# Altium schematic sheet Sheet1.SchDoc
size A4
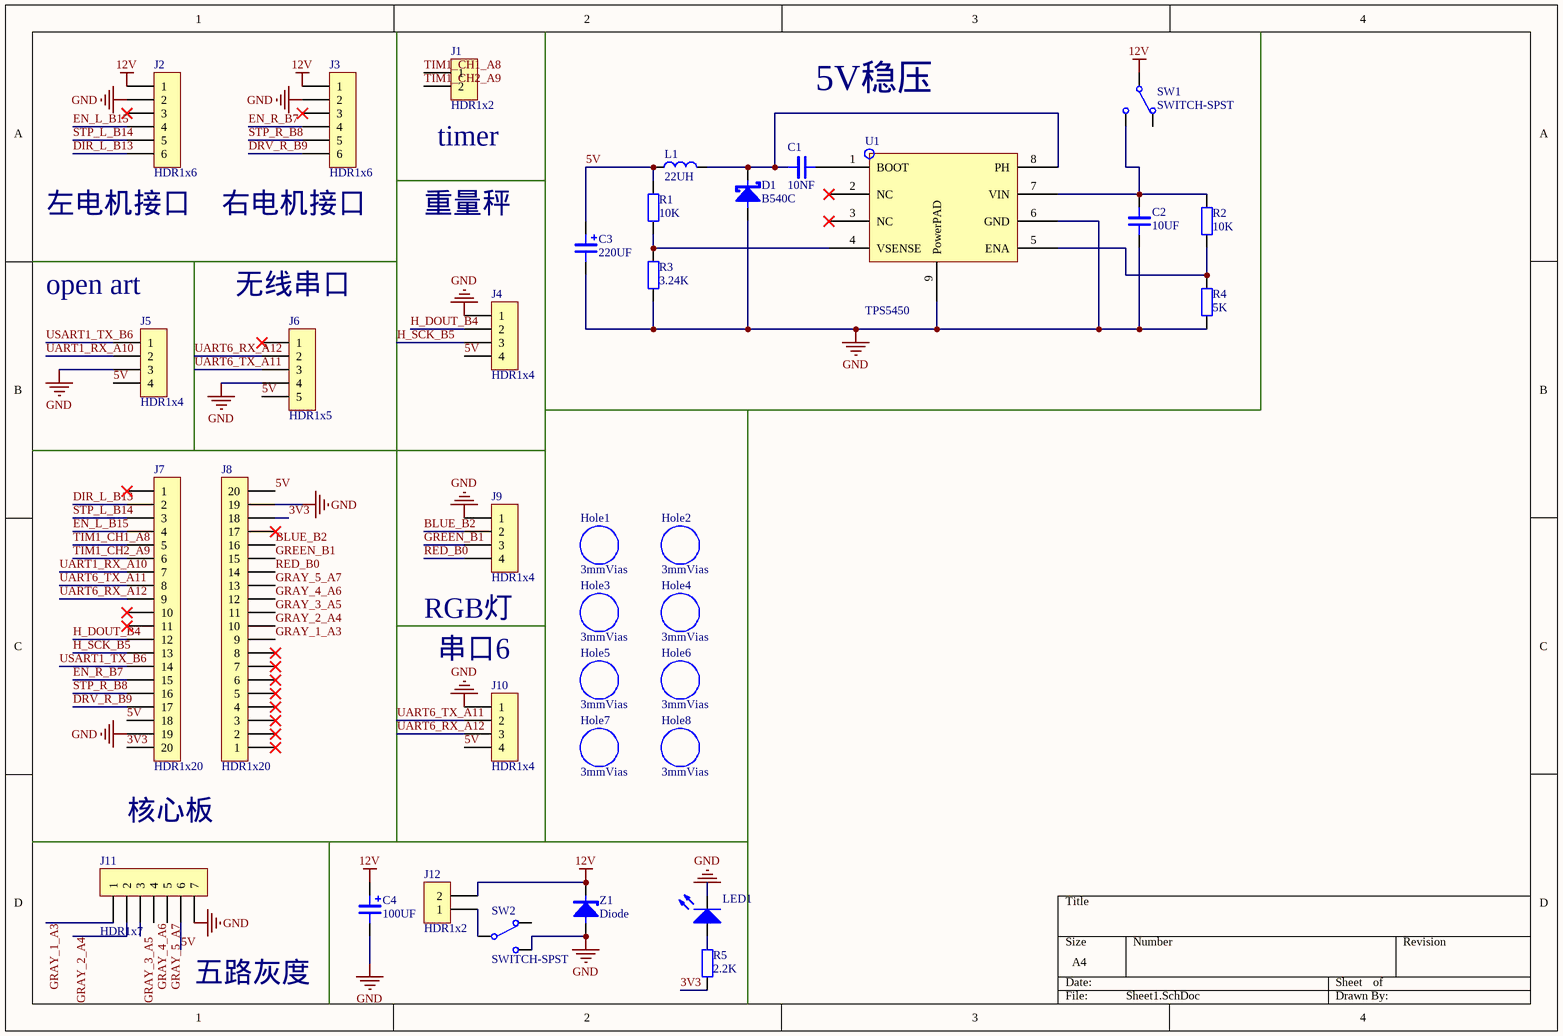
[diagram p0: Sheet1.SchDoc]

## Parts
C1  10NF  [0603]
C2  10UF  [0603]
C3  220UF  [DIP-EC3.5X8X11.5]
C4  100UF  [DIP-EC2.5X6.3X11.2]
D1  B540C  [SMC]
Hole1  3mmVias  [3mm]
Hole2  3mmVias  [3mm]
Hole3  3mmVias  [3mm]
Hole4  3mmVias  [3mm]
Hole5  3mmVias  [3mm]
Hole6  3mmVias  [3mm]
Hole7  3mmVias  [3mm]
Hole8  3mmVias  [3mm]
J1  HDR1x2  [PIN-2-2.54-1.0]
J2  HDR1x6  [XH6/2.54mm/90]
J3  HDR1x6  [XH6/2.54mm/90]
J4  HDR1x4  [PIN-4-2.54-1.0]
J5  HDR1x4  [XH4/2.54mm/180]
J6  HDR1x5  [PIN-5-2.54-1.0]
J7  HDR1x20  [Fe-HDR1X20/2.54-S]
J8  HDR1x20  [Fe-HDR1X20/2.54-S]
J9  HDR1x4  [PIN-4-2.54-1.0]
J10  HDR1x4  [XH4/2.54mm/180]
J11  HDR1x7  [PIN-7-2.54-1.0]
J12  HDR1x2  [KF301]
L1  22UH  [CDRH127]
LED1  LED0  [0603-led]  (value not drawn)
R1  10K  [0603]
R2  10K  [0603]
R3  3.24K  [0603]
R4  5K  [0603]
R5  2.2K  [0603]
SW1  SWITCH-SPST  [ss12d10]
SW2  SWITCH-SPST  [ss12d10]
U1  TPS5450  [TPS5450]
Z1  Diode  [1N5824]

## Nets
12V: C4.1 J2.1 J3.1 J12.2 SW1.2 Z1.2(C)
GND: C2.1 C3.2 C4.2 D1.1(A) J2.2 J3.2 J4.1 J5.3 J6.4 J7.19 J8.19 J9.1 J10.1 J11.7 LED1.2(K) R3.1 R4.1 SW2.3 U1.6(GND) U1.9(PowerPAD) Z1.1(A)
3V3: J7.20 J8.18 R5.1
5V: C3.1 J4.4 J5.4 J6.5 J7.18 J8.20 J10.4 J11.6 L1.1 R1.2
BLUE_B2: J8.16 J9.2
DIR_L_B13: J2.6 J7.2
DRV_R_B9: J3.6 J7.17
EN_L_B15: J2.4 J7.4
EN_R_B7: J3.4 J7.15
GRAY_1_A3: J8.9 J11.1
GRAY_2_A4: J8.10 J11.2
GRAY_3_A5: J8.11 J11.3
GRAY_4_A6: J8.12 J11.4
GRAY_5_A7: J8.13 J11.5
GREEN_B1: J8.15 J9.3
H_DOUT_B4: J4.2 J7.12
H_SCK_B5: J4.3 J7.13
RED_B0: J8.14 J9.4
STP_L_B14: J2.5 J7.3
STP_R_B8: J3.5 J7.16
TIM1_CH1_A8: J1.1 J7.5
TIM1_CH2_A9: J1.2 J7.6
UART1_RX_A10: J5.2 J7.7
UART6_RX_A12: J6.2 J7.9 J10.3
UART6_TX_A11: J6.3 J7.8 J10.2
USART1_TX_B6: J5.1 J7.14
NetC1_1: C1.1 U1.1(BOOT)
NetC1_2: C1.2 D1.2(C) L1.2 U1.8(PH)
NetC2_2: C2.2 R2.2 SW1.3 U1.7(VIN)
NetJ12_1: J12.1 SW2.2
NetLED1_1: LED1.1(A) R5.2
NetR1_1: R1.1 R3.2 U1.4(VSENSE)
NetR2_1: R2.1 R4.2 U1.5(ENA)

Not connected (* = marked no-connect by the designer): J2 3*; J3 3*; J6 1*; J7 1* 10* 11*; J8 1* 2* 3* 4* 5* 6* 7* 8* 17*; SW1 1; SW2 1; U1 2(NC)* 3(NC)*

## Notes on the sheet
- 5V稳压
- (near J1) timer
- (near J2) 左电机接口
- 右电机接口
- 重量秤
- (near J5) open art
- (near J6) 无线串口
- (near J9) RGB灯
- (near J10) 串口6
- 核心板
- 五路灰度

## Library data of the parts
C1 C2 = CAP: Capacitor
C3 C4 = CAP-TANTALUM: Tantalum Capacitor
D1 = SS5x: Schottky Diode
J1 J12 = HDR1x2: Connector
J2 J3 = HDR1x6: Connector
J4 J5 J9 J10 = HDR1x4: Connector
J6 = HDR1x5: Connector
J7 J8 = HDR1x20: Connector
J11 = HDR1x7: Connector
L1 = INDUCTANCE
LED1 = LED0: Typical INFRARED GaAs LED; Published: 8-Jun-2000; LatestRevisionDate: 08-Jul-2005; LatestRevisionNote: Mech Layer 1 removed.; PackageReference: LED-0; Publisher: Altium Limited; PackageDescription: LED; 2 Leads
R1-R5 = RES: Resistor
SW1 SW2 = SWITCH-SPST: Switch
Z1 = Diode: Zener Diode